# Altium project ECD_Project.PrjPcb
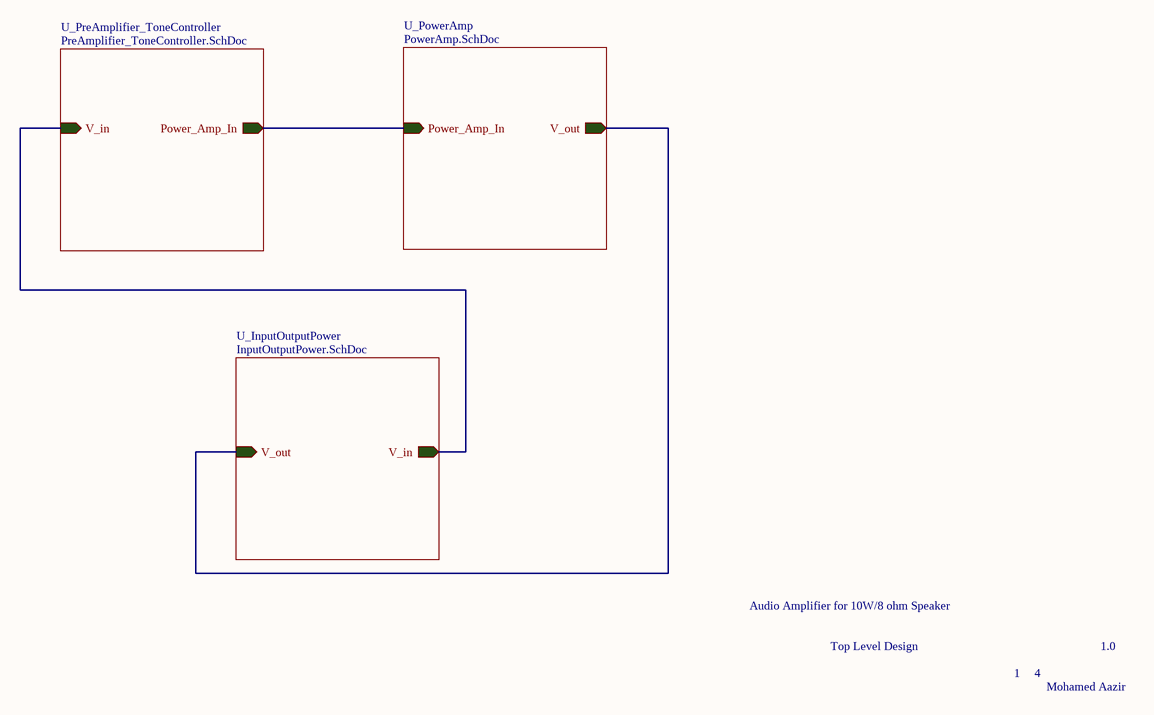
[diagram p0: TopLevelDesign.SchDoc]
4 sheets, 35 parts. Net scope: hierarchical (ports join the sheet entries above them; power ports are global).
Board file: ECD_Project.PcbDoc
Sheets:
  TopLevelDesign.SchDoc
    U_PreAmplifier_ToneController = PreAmplifier_ToneController.SchDoc
    U_PowerAmp = PowerAmp.SchDoc
    U_InputOutputPower = InputOutputPower.SchDoc

## Sheet TopLevelDesign.SchDoc
size A4; SheetNumber: 1; SheetTotal: 3

### Sub-sheets
U_InputOutputPower = InputOutputPower.SchDoc: V_out (in), V_in (out)
U_PowerAmp = PowerAmp.SchDoc: Power_Amp_In (in), V_out (out)
U_PreAmplifier_ToneController = PreAmplifier_ToneController.SchDoc: V_in (in), Power_Amp_In (out)

### Nets
V_in: sheet U_PreAmplifier_ToneController/V_in, sheet U_InputOutputPower/V_in
V_out: sheet U_PowerAmp/V_out, sheet U_InputOutputPower/V_out
NetC5_1: sheet U_PreAmplifier_ToneController/Power_Amp_In, sheet U_PowerAmp/Power_Amp_In

### Notes on the sheet
- Audio Amplifier for 10W/8 ohm Speaker
- Top Level Design
- 1
- 4
- 1.0
- Mohamed Aazir

## Sheet PreAmplifier_ToneController.SchDoc
size A4; SheetNumber: 3; SheetTotal: 4
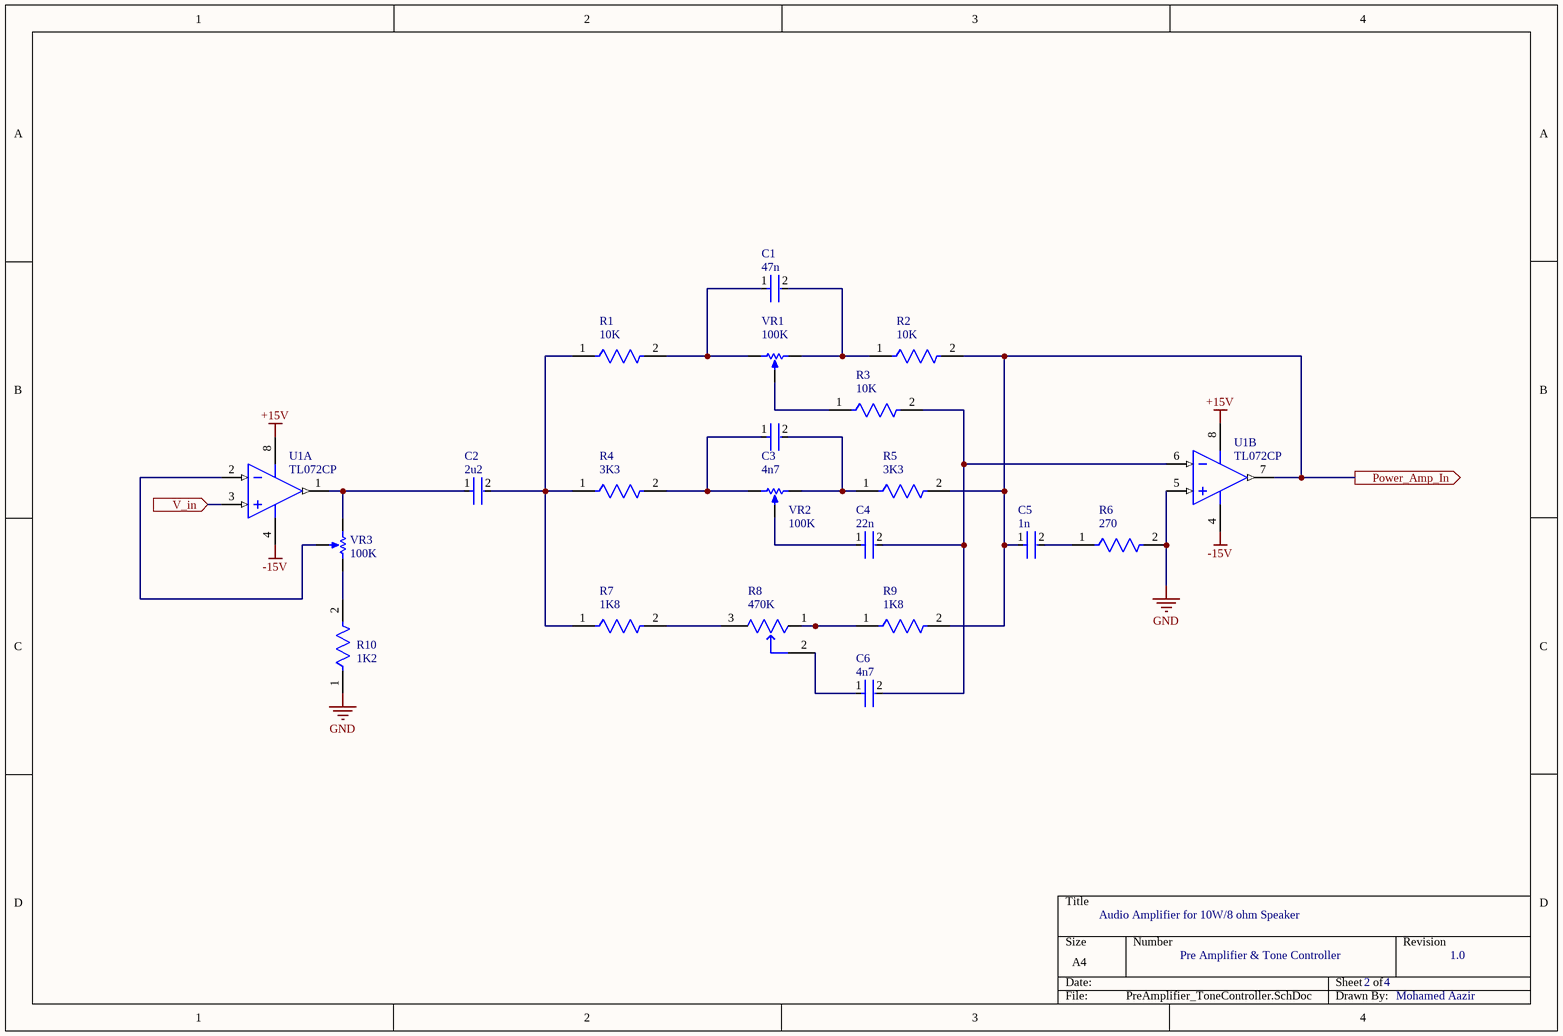
[diagram p1: PreAmplifier_ToneController.SchDoc]

### Parts
C1  47n  [FP-RAD-TH-D_5_0_5-L_11_1-MFG]
C2  2u2  [FP-RAD-TH-D_5_0_5-L_11_1-MFG]
C3  4n7  [FP-RAD-TH-D_5_0_5-L_11_1-MFG]
C4  22n  [FP-RAD-TH-D_5_0_5-L_11_1-MFG]
C5  1n  [FP-RAD-TH-D_5_0_5-L_11_1-MFG]
C6  4n7  [FP-RAD-TH-D_5_0_5-L_11_1-MFG]
R1  10K  [FP-MFR-25-MFG]
R2  10K  [FP-MFR-25-MFG]
R3  10K  [FP-MFR-25-MFG]
R4  3K3  [FP-MFR-25-MFG]
R5  3K3  [FP-MFR-25-MFG]
R6  270  [FP-MFR-25-MFG]
R7  1K8  [FP-MFR-25-MFG]
R8  470K  [FP-PV37W-MFG]
R9  1K8  [FP-MFR-25-MFG]
R10  1K2  [FP-MFR-25-MFG]
U1  TL072CP  [P0008A]  (parts A,B of 2)
VR1  100K  [BOUR-3362P]
VR2  100K  [BOUR-3362P]
VR3  100K  [BOUR-3362P]

### Ports
Power_Amp_In (out, see TopLevelDesign[2B], PowerAmp[2C]), V_in (in, see TopLevelDesign[2B], InputOutputPower[3B])

### Nets
+15V: U1.8(VCC+)
-15V: U1.4(VCC-)
GND: R6.2 R10.1 U1.5(IN2+)
V_in: U1.3(IN1+) ; port V_in
NetC1_1: C1.1 R1.2 VR1.1(CCW)
NetC1_2: C1.2 R2.1 VR1.3(CW)
NetC2_1: C2.1 U1.1(OUT1) VR3.1(CCW)
NetC2_2: C2.2 R1.1 R4.1 R7.1
NetC3_1: C3.1 R4.2 VR2.1(CCW)
NetC3_2: C3.2 R5.1 VR2.3(CW)
NetC4_1: C4.1 VR2.2(S)
NetC4_2: C4.2 C6.2 R3.2 U1.6(IN2-)
NetC5_1: C5.1 R2.2 R5.2 R9.2 U1.7(OUT2) ; port Power_Amp_In
NetC5_2: C5.2 R6.1
NetC6_1: C6.1 R8.2
NetR3_1: R3.1 VR1.2(S)
NetR7_2: R7.2 R8.3
NetR8_1: R8.1 R9.1
NetR10_2: R10.2 VR3.3(CW)
NetU1_2: U1.2(IN1-) VR3.2(S)

### Notes on the sheet
- Audio Amplifier for 10W/8 ohm Speaker
- Pre Amplifier & Tone Controller
- 2
- 4
- 1.0
- Mohamed Aazir

### Library data of the parts
C1-C6 = CMP-05427-002189-1: Aluminum Electrolytic Capacitors (Radial Lead Type) 22uF ±20% 25V; Dissipation Factor: 0.15%; Ripple Current: 60mA; Life (Hours): 2000Hour; Leakage Current: 3mA; Polarity: Bipolar; Lead Diameter: 0.5mm; Voltage Rating (DC): 25V; Capacitance: 22uF; Height: 11mm; Construction: RADIAL; Min Operating Temperature: -40°C; Tolerance: 20%; Max Operating Temperature: 85°C; Reach SVHC Compliant: Yes; Diameter: 5mm; Package Quantity: 200; Case/Package: Radial; Mount: Through Hole; Length: 11mm; Radiation Hardening: No; Size: 11mm; Height - Seated (Max): 0.433inch; Packaging: Bulk; Series: SU; Termination: Radial; Voltage: 25V; Voltage Rating: 25V; Lead Pitch: 2mm; RoHS Compliant: Yes; Lead Free: Lead Free
R1-R7 R9 R10 = CMP-03413-000001-1: RES 1.18K OHM 1/4W 1% AXIAL; Manufacturer: Yageo; Manufacturer Part Number: MFR-25FBF52-1K18; Value: 1.18kΩ; Temperature Coefficient: 100ppm/°C; Power Rating: 0.25W; Voltage Rating: 250V; Temperature: -55°C to +155°C; Automotive: No; Temperature Range High: +155°C; Mouser Description: Metal Film Resistors 1.18K OHM 1/4W 1%; Digikey Description: RES 1.18K OHM 1/4W 1% AXIAL; Lead Free: Yes; Tolerance: 1%; ComponentLink2Description: Datasheet; ComponentLink2URL: https://www.yageo.com/upload/media/product/products/datasheet/lr/Yageo_LR_MFR_1.pdf; Temperature Range Low: -55°C; Package: MFR-25; Ipc Land Pattern Name: RESAD1000W75L680D260; Composition: Metal Film; Category: Res; Octopart: https://octopart.com/mfr-25fbf52-1k18-yageo-56251681; Series: MFR; Device Class L2: Resistors; Height: 2.6mm; Resistance: 1.18kΩ; Device Class L3: Through-Hole Resistors; RoHS: TRUE; Device Class L1: Passive Components
R8 = CMP-07234-000004-1: TRIMMER 500KOHM 0.25W PC PIN TOP; Manufacturer Part Number: PV37W504C01B00; Manufacturer: Bourns; Value: 500kΩ; Tolerance: 10%; Temperature Coefficient: 150ppm/°C; Standoff Height: 0.33mm; Temperature Range Low: -55°C; Package: PV37W; Height: 9.02mm; Series: PV37; Mouser Description: Res Cermet Trimmer 500K Ohm 10% 1/4W 12(Elec)Turn 1.8mm (6.4 X 4 X 7.7mm) Pin Thru-Hole Bulk; Power Rating: 0.25W; Device Class L3: Variable Resistors and Potentiometers; Device Class L2: Resistors; Category: Res; RoHS: TRUE; Lead Free: Yes; Composition: Cermet; Automotive: No; Digikey Description: TRIMMER 500KOHM 0.25W PC PIN TOP; Temperature Range High: +125°C; Resistance: 500kΩ; Temperature: -55°C to +125°C; Octopart: https://octopart.com/pv37w504c01b00-bourns-71526902; Device Class L1: Passive Components; ComponentLink2Description: Datasheet; ComponentLink2URL: https://www.bourns.com/docs/Product-Datasheets/pv37.pdf
U1 = CMP-0017-00950-2: Dual Low-Noise JFET-Input General-Purpose Operational Amplifier, 7 to 36 V, 0 to 70 degC, 8-pin DIP (P8), Pb-Free (RoHS); Manufacturer: Texas Instruments; Sub Family: General Purpose Amplifier, High Supply Voltage Amplifier (>=30V); Total Supply Voltage(Max)(+5V is 5, +/-5V is 10): 36; Slew Rate(Typ)(V/us): 13; Vn at 1kHz(Typ)(nV/rtHz): 18; GBW(Typ)(MHz): 3; CMRR(Min)(dB): 70; Total Supply Voltage(Min)(+5V is 5, +/-5V is 10): 7; Vio (25C)(Max)(mV): 10; Rating: Catalog; IIB(Max)(pA): 200; Iq per channel(Max)(mA): 2.5; Number of Channels: 2; Mounting Technology: Through Hole; ComponentLink3Description: Package Specification; PartNumber: TL072CP; PackageVersion: 4040082/E, 04/2010; Eco-Plan: Pb-Free (RoHS); DatasheetVersion: SLOS080J; Offset Drift(Typ)(uV/C): 18; ComponentLink3URL: http://www.ti.com/litv/pdf/mpdi001b; PackageDescription: 8-Pin Plastic In-Line, Body 9.59 x 6.35 mm, Pitch 2.54 mm; Code_JEDEC: MS-001; ComponentLink2URL: http://www.ti.com/lit/ds/symlink/tl072.pdf; ComponentLink1Description: Manufacturer URL; ComponentLink2Description: Datasheet; ComponentLink1URL: http://www.ti.com/; PackageReference: P0008A
VR1-VR3 = CMP-1747-00003-1: Square Trimpot(R) Trimming Potentiometer, 100 KOhm, 300 V, -55 to 125 degC, 3-Pin THD, RoHS, Tube; Voltage Rating: 250 V; Case\Package: Axial; Tolerance: 1%; Power Rating: 250 mW; Resistance: 1 mohm; RoHSCompliant: true; ComponentLink2URL: http://www.bourns.com/docs/Product-Datasheets/3362.pdf; ComponentLink1Description: Manufacturer URL; DatasheetVersion: May-16; Package Quantity: 200; ComponentLink2Description: Datasheet; Min Operating Temperature: -55 degC; Mount: Through Hole; PackageDescription: 3-Pin Through Hole Device, Body 6.6 x 6.99 mm, Pitch 2.54 mm; Length: 0.248 inch; ComponentLink1URL: http://www.bourns.com/; PackageReference: 3326P; Max Operating Temperature: 155 degC; Packaging: Bulk

## Sheet PowerAmp.SchDoc
size A4; SheetNumber: 4; SheetTotal: 4
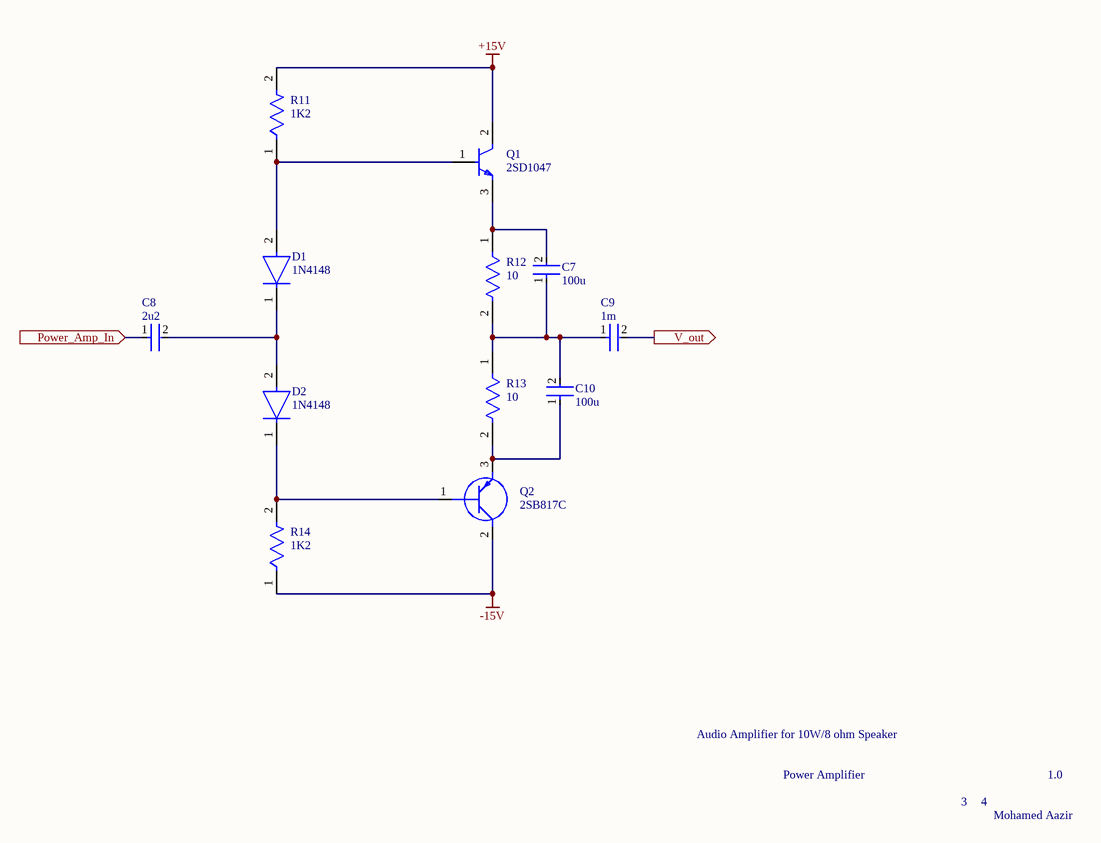
[diagram p2: PowerAmp.SchDoc]

### Parts
C7  100u  [FP-RAD-TH-D_5_0_5-L_11_1-MFG]
C8  2u2  [FP-RAD-TH-D_5_0_5-L_11_1-MFG]
C9  1m  [FP-RAD-TH-D_5_0_5-L_11_1-MFG]
C10  100u  [FP-RAD-TH-D_5_0_5-L_11_1-MFG]
D1  1N4148  [FP-017AG-MFG]
D2  1N4148  [FP-017AG-MFG]
Q1  2SD1047  [FP-2SD1047-MFG]
Q2  2SB817C  [TO545P500X1560X2380-3P]
R11  1K2  [FP-MFR-25-MFG]
R12  10  [FP-HVR37-MFG]
R13  10  [FP-HVR37-MFG]
R14  1K2  [FP-MFR-25-MFG]

### Ports
Power_Amp_In (in, see TopLevelDesign[2B], PreAmplifier_ToneController[4B]), V_out (out, see TopLevelDesign[3B], InputOutputPower[2B])

### Nets
+15V: Q1.2(C) R11.2
-15V: Q2.2(C) R14.1
V_out: C9.2 ; port V_out
NetC5_1: C8.1 ; port Power_Amp_In
NetC7_1: C7.1 C9.1 C10.2 R12.2 R13.1
NetC7_2: C7.2 Q1.3(E) R12.1
NetC8_2: C8.2 D1.1(C) D2.2(A)
NetC10_1: C10.1 Q2.3(E) R13.2
NetD1_2: D1.2(A) Q1.1(B) R11.1
NetD2_1: D2.1(C) Q2.1(B) R14.2

### Notes on the sheet
- Audio Amplifier for 10W/8 ohm Speaker
- Power Amplifier
- 3
- 4
- 1.0
- Mohamed Aazir

### Library data of the parts
C7-C10 = CMP-05427-002189-1: as C1 on sheet PreAmplifier_ToneController; Voltage Rating (DC): 25V; Capacitance: 22uF; Height: 11mm; Construction: RADIAL; Min Operating Temperature: -40°C; Tolerance: 20%; Max Operating Temperature: 85°C; Reach SVHC Compliant: Yes; Diameter: 5mm; Package Quantity: 200; Case/Package: Radial; Mount: Through Hole; Length: 11mm; Radiation Hardening: No; Size: 11mm; Height - Seated (Max): 0.433inch; Packaging: Bulk; Series: SU; Termination: Radial; Voltage: 25V; Voltage Rating: 25V; Lead Pitch: 2mm; RoHS Compliant: Yes; Lead Free: Lead Free
D1 D2 = CMP-07163-000046-1: DIODE GEN PURP 100V 200MA DO35; Forward Voltage: 1V; Max Power Dissipation: 500mW; Max Reverse Current: 5uA; Forward Current: 300mA; Current: 4A; Reverse Recovery Time: 4ns; Element Configuration: Single; Outside Diameter: 1.85mm; Capacitance: 4pF; Polarity: Standard; Max Forward Surge Current (Ifsm): 1A; Reverse Voltage: 100V; Output Current: 200mA; Average Rectified Current: 200mA; Diameter: 1.91mm; Max Repetitive Reverse Voltage (Vrrm): 100V; Current Rating: 200mA; Case/Package: DO-35; Lead Free: Lead Free; Number of Pins: 2; Recovery Time: 4ns; Packaging: Bulk; Contact Plating: Tin; Voltage: 100V; Mount: Through Hole; Max Surge Current: 4A; Package Quantity: 2000; Width: 1.91mm; Max Reverse Voltage (DC): 100V; Length: 4.56mm; Radiation Hardening: No; Power Dissipation: 500mW; Voltage Rating (DC): 100V; Peak Non-Repetitive Surge Current: 4A; REACH SVHC: No SVHC; Height: 4.56mm; Max Operating Temperature: 175°C; Series: -; Weight: 0.01lb; Min Operating Temperature: -65°C
Q1 = CMP-12195-000011-1: TRANS NPN 140V 12A TO-3P; Frequency: 20MHz; Max Power Dissipation: 100W; Collector-emitter Voltage-Max: 700mV; hFE Min: 50; Emitter Base Voltage (VEBO): 6V; Number of Elements: 1; Collector Base Voltage (VCBO): 200V; Min Operating Temperature: -65°C; Collector Emitter Voltage (VCEO): 140V; Transition Frequency: 20MHz; RoHS Compliant: Yes; Mount: Through Hole; Gain Bandwidth Product: 20MHz; Packaging: Rail/Tube; Contact Plating: Tin; Radiation Hardening: No; Polarity: NPN; Max Collector Current: 12A; REACH SVHC: No SVHC; Power Dissipation: 100W; Number of Pins: 3; Max Operating Temperature: 150°C; Package Quantity: 30; Lead Free: Lead Free; Series: -; Collector Emitter Breakdown Voltage: 140V
Q2 = 2SB817C: Transistor BJT PNP; Manufacturer_Name: onsemi; Datasheet Link: https://www.onsemi.com/pub/Collateral/ENA0188-D.PDF; Height: 5mm; Manufacturer_Part_Number: 2SB817C; Mouser Part Number: N/A; Mouser Price/Stock: https://www.mouser.co.uk/ProductDetail/ON-Semiconductor/2SB817C?qs=%252BEew9%252B0nqrC40L4G7JJ6Fg%3D%3D
R11 R14 = CMP-03413-000001-1: as R1 on sheet PreAmplifier_ToneController; Temperature: -55°C to +155°C; Automotive: No; Temperature Range High: +155°C; Mouser Description: Metal Film Resistors 1.18K OHM 1/4W 1%; Digikey Description: RES 1.18K OHM 1/4W 1% AXIAL; Lead Free: Yes; Tolerance: 1%; ComponentLink2Description: Datasheet; ComponentLink2URL: https://www.yageo.com/upload/media/product/products/datasheet/lr/Yageo_LR_MFR_1.pdf; Temperature Range Low: -55°C; Package: MFR-25; Ipc Land Pattern Name: RESAD1000W75L680D260; Composition: Metal Film; Category: Res; Octopart: https://octopart.com/mfr-25fbf52-1k18-yageo-56251681; Series: MFR; Device Class L2: Resistors; Height: 2.6mm; Resistance: 1.18kΩ; Device Class L3: Through-Hole Resistors; RoHS: TRUE; Device Class L1: Passive Components
R12 R13 = CMP-00030-42845042-1: HVR3700001004FR500 Fixed Resistor, Metal Film, 0.5W, 1000000ohm, 3500V, 1% +/-Tol, 200ppm/Cel, Through Hole Mount; Resistance: 1MΩ; Voltage Rating: 3.5kV; Max Power Dissipation: 500mW; Lead Diameter: 780µm; Temperature Coefficient: 200ppm/°C; Number of Pins: 2; Composition: Metal Film; Features: Flame Retardant Coating; Schedule B: 8533210090, 8533210090; RoHS: Compliant; Voltage Rating (DC): 3.5kV; Min Operating Temperature: -55°C; REACH SVHC: Unknown; Tolerance: 1%; Termination: Axial; Radiation Hardening: No; Height: 4mm; Packaging: Cut Tape (CT); Length: 10.0076mm; Number of Terminations: 2; Max Operating Temperature: 155°C; Power Rating: 500mW; NexarPartId: 42845042; Lead Free: Lead Free; Case/Package: Axial

## Sheet InputOutputPower.SchDoc
size A4; SheetNumber: 2; SheetTotal: 4
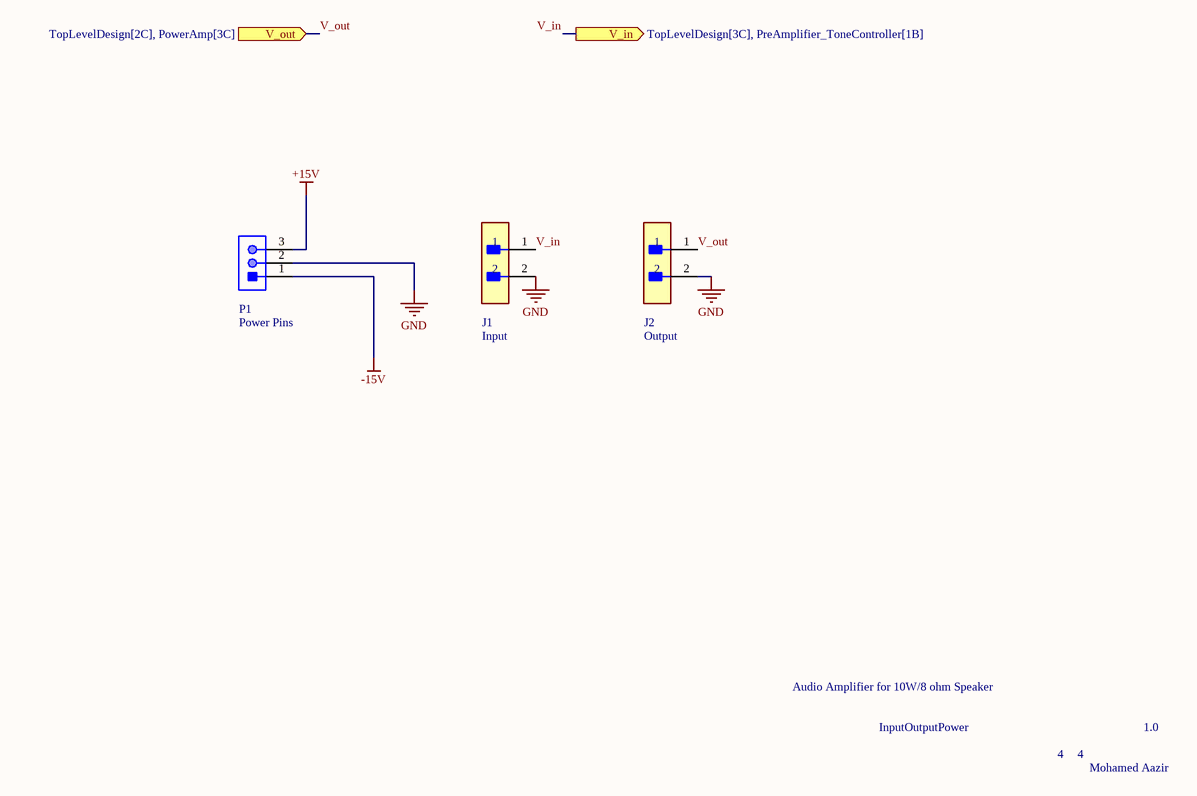
[diagram p3: InputOutputPower.SchDoc]

### Parts
J1  Input  [FP-B2B-EH-A_LF_SN-MFG]
J2  Output  [FP-B2B-EH-A_LF_SN-MFG]
P1  Power Pins  [JST-B3B-PH-K-S-3_V]

### Ports
V_in (out, see TopLevelDesign[3C], PreAmplifier_ToneController[1B]), V_out (in, see TopLevelDesign[2C], PowerAmp[3C])

### Nets
+15V: P1.3
-15V: P1.1
GND: J1.2 J2.2 P1.2
V_in: J1.1 ; port V_in
V_out: J2.1 ; port V_out

### Notes on the sheet
- Audio Amplifier for 10W/8 ohm Speaker
- InputOutputPower
- 4
- 1.0
- Mohamed Aazir

### Library data of the parts
J1 J2 = CMP-17439-000026-1: CONN HEADER VERT 2POS 2.5MM; Number of Contacts: 2; Current Rating: 3A; Connector Type: Plug; Contact Resistance: 20mR; Gender: Male; Voltage Rating: 250V; Fastening Type: Detent; Depth: 3.8mm; Max Operating Temperature: 85°C; Orientation: Straight; Series: EH; Contact Plating: Tin; Min Operating Temperature: -25°C; Contact Type: Male Pin; Housing Color: White; Termination: Press-Fit; Housing Material: Nylon; Pitch: 2.5mm; Number of Positions: 2; Max Current Rating: 3A; Packaging: Bulk; Lead Free: Lead Free; Number of Rows: 1; Length: 7.5mm; Contact Mating Length: 0.13inch; Color: Natural; Max Voltage Rating (AC): 250V; Contact Material: Copper Alloy; Mount: Through Hole
P1 = CMP-2000-05164-1: Male Header, Pitch 2 mm, 1 x 3 Position, Height 6 mm, Tail Length 3.4 mm, -25 to 85 degC, RoHS, Bulk; Manufacturer: JST; Style/Orientation: StraightHeader/Plug; Pitch: 2mm; No of Positions: 3; Termination: Crimp; Manufacturer URL: http://www.jst.com/home2.html; Datasheet Version: Oct-06; Type: ShroudedHeader; Datasheet URL: https://datasheet.ciiva.com/11746/0900766b80826550-11746939.pdf

## Nets that join several sheets
+15V: PreAmplifier_ToneController (U1.8), PowerAmp (Q1.2 R11.2), InputOutputPower (P1.3)
-15V: PreAmplifier_ToneController (U1.4), PowerAmp (Q2.2 R14.1), InputOutputPower (P1.1)
GND: PreAmplifier_ToneController (R6.2 R10.1 U1.5), InputOutputPower (J1.2 J2.2 P1.2)
NetC5_1: PreAmplifier_ToneController (5 pins), PowerAmp (C8.1)
V_in: PreAmplifier_ToneController (U1.3), InputOutputPower (J1.1)
V_out: PowerAmp (C9.2), InputOutputPower (J2.1)